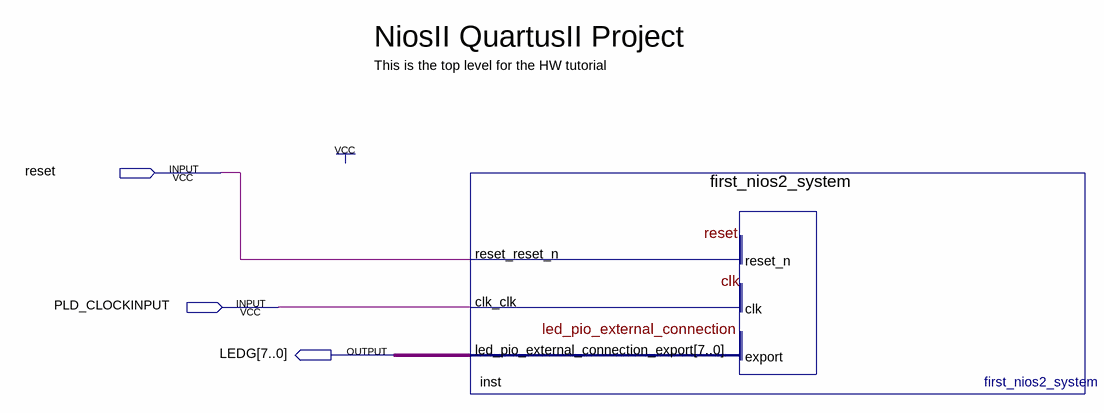
[diagram p0: schematic sheet]
// Quartus schematic nios2_quartus2_project.bdf as structural Verilog: 1 symbols, 3 pins
module nios2_quartus2_project (
  input  reset,
  input  PLD_CLOCKINPUT,
  output [7:0] LEDG
);

  first_nios2_system inst (.reset_reset_n(reset), .clk_clk(PLD_CLOCKINPUT), .led_pio_external_connection_export(LEDG));

  // Notes on the sheet:
  //   NiosII QuartusII Project
  //   This is the top level for the HW tutorial
endmodule
